# EAGLE design mini_optronV3 (EAGLE 9.3.1)
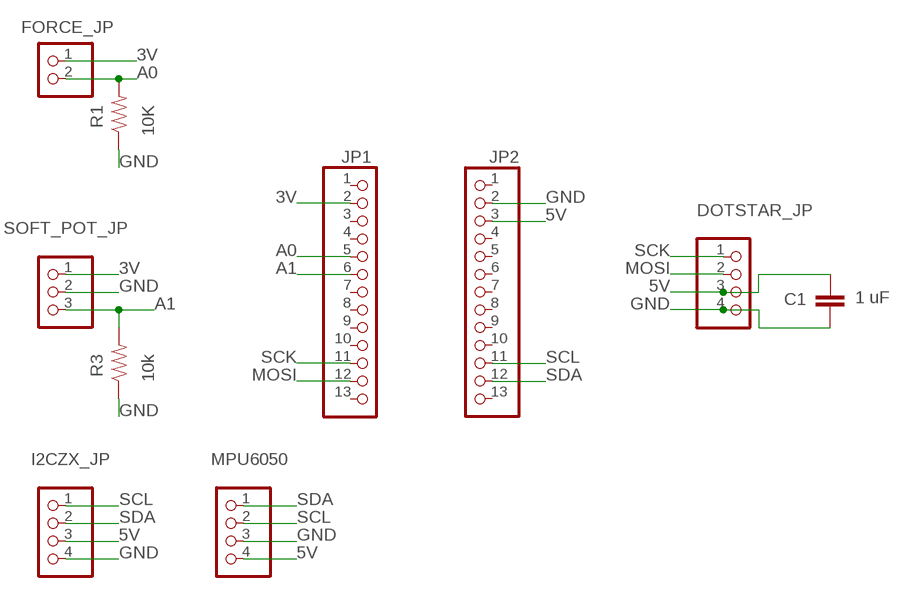
[diagram p0: schematic, sheet 1]

## Parts
C1  1 uF  C5/7.2  [C5B7.2]
DOTSTAR_JP  PINHD-1X4  [1X04]
FORCE_JP  PINHD-1X2  [1X02]
I2CZX_JP  PINHD-1X4  [1X04]
JP1  PINHD-1X13_BIG  [1X13-BIG]
JP2  PINHD-1X13_BIG  [1X13-BIG]
MPU6050  PINHD-1X4  [1X04]
R1  10K  RESISTORAXIAL-0.3  [AXIAL-0.3]
R3  10k  RESISTORAXIAL-0.3  [AXIAL-0.3]
SOFT_POT_JP  PINHD-1X3  [1X03]

## Nets
3V: FORCE_JP.1 JP1.2 SOFT_POT_JP.1
5V: C1.1 DOTSTAR_JP.3 I2CZX_JP.3 JP2.3 MPU6050.4
A0: FORCE_JP.2 JP1.5 R1.P$2
A1: JP1.6 R3.P$2 SOFT_POT_JP.3
GND: C1.2 DOTSTAR_JP.4 I2CZX_JP.4 JP2.2 MPU6050.3 R1.P$1 R3.P$1 SOFT_POT_JP.2
MOSI: DOTSTAR_JP.2 JP1.12
SCK: DOTSTAR_JP.1 JP1.11
SCL: I2CZX_JP.1 JP2.11 MPU6050.2
SDA: I2CZX_JP.2 JP2.12 MPU6050.1
Unconnected: JP1.1 JP1.3 JP1.4 JP1.7 JP1.8 JP1.9 JP1.10 JP1.13 JP2.1 JP2.4 JP2.5 JP2.6 JP2.7 JP2.8 JP2.9 JP2.10 JP2.13

## Library data of the parts
C1 = capacitor-wima:C: CAPACITOR naming: grid - package width; MF: AVX; MPN: 0805YD105KAT2A; OC_NEWARK: 95W9236
DOTSTAR_JP I2CZX_JP MPU6050 = pinhead:PINHD-1X4: PIN HEADER
FORCE_JP = pinhead:PINHD-1X2: PIN HEADER
JP1 JP2 = adafruit:PINHD-1X13: PIN HEADER; OC_NEWARK: unknown
R1 R3 = SparkFun-Resistors:RESISTOR: Generic Resistor Package; MF: VISHAY; MPN: CRCW060310K0FKEA; OC_NEWARK: 52K8063
SOFT_POT_JP = pinhead:PINHD-1X3: PIN HEADER

## Net classes
0 default: width 0.305 mm, drill 0.508 mm, clearance 0.254 mm

## Board
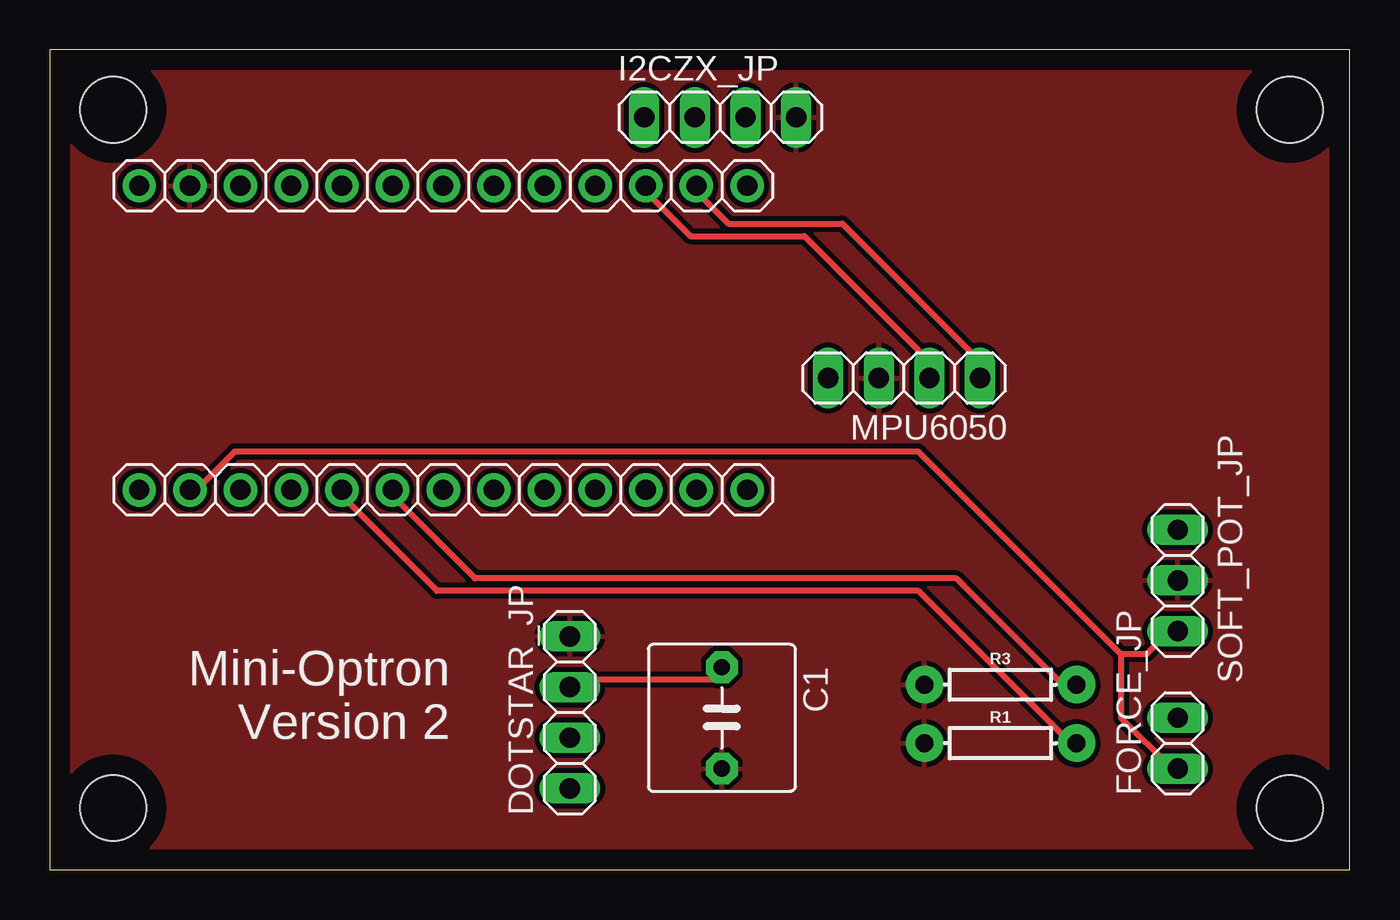
[diagram p1: board, top side]
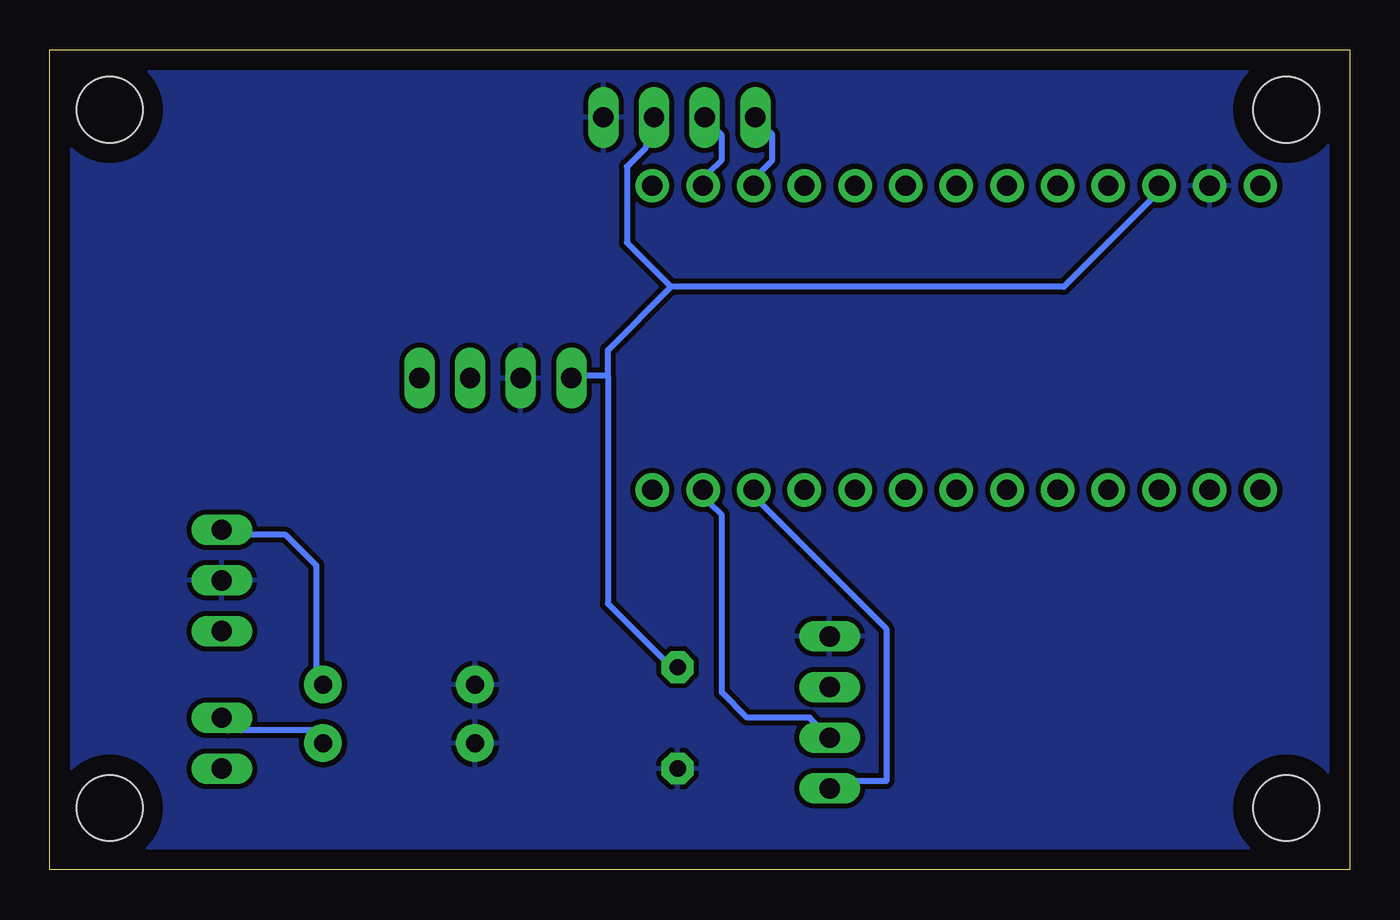
[diagram p2: board, bottom side, seen from below]

Size 65.17 x 41.09 mm. Coordinates in mm from the lower left corner, seen from the top.
Outline: 65.17,41.09 0,41.09 0,0 65.17,0 65.17,41.09
Copper layers (1*16): Top 0.035mm / dielectric 1.5mm / Bottom 0.035mm
Design rules "default": minimum track width 6mil, minimum drill 0.35mm, track to track 6mil, track to pad 6mil, pad to pad 6mil, via to via 6mil, smd to smd 6mil, copper to edge 40mil, drill to drill 6mil, minimum pad ring 10mil, minimum via ring 8mil, stop-mask expansion 4mil, vias tented up to drill 0mil, thermal gap 10mil
Holes 3.3 mm at 62.17,38.09 62.17,3.09 3.17,3.09 3.17,38.09

### Footprints (pad centres in the part's own frame; a part is rotated, then mirrored left to right if it is on the bottom)
C5B7.2 = drill 0.813 pad 1.6 octagon: 1 -2.54,0; 2 2.54,0
1X04 = drill 1.016 long: 1 -3.81,0; 2 -1.27,0; 3 1.27,0; 4 3.81,0
1X02 = drill 1.016 long: 1 -1.27,0; 2 1.27,0
1X13-BIG = drill 1.016 pad 1.676: 1 -15.24,0; 2 -12.7,0; 3 -10.16,0; 4 -7.62,0; 5 -5.08,0; 6 -2.54,0; 7 0,0; 8 2.54,0; 9 5.08,0; 10 7.62,0; 11 10.16,0; 12 12.7,0; 13 15.24,0
AXIAL-0.3 = drill 0.9 pad 1.88: P$1 -3.81,0; P$2 3.81,0
1X03 = drill 1.016 long: 1 -2.54,0; 2 0,0; 3 2.54,0

### Placement (x,y rotation side)
C1  33.69,7.61 270 top
DOTSTAR_JP  26.07,7.88 90 top
FORCE_JP  56.55,6.34 90 top
I2CZX_JP  33.61,37.71 0 top
JP1  19.72,19.04 0 top
JP2  19.72,34.28 0 top
MPU6050  42.83,24.64 180 top
R1  47.66,6.34 0 top
R3  47.66,9.27 0 top
SOFT_POT_JP  56.55,14.5 90 top

### Tracks (layer width: path | path; a pad name or v marks a point on that pad's centre or on a via)
3V
  Top 0.305: 53.7,10.8 53.7,7.62 56.24,5.08 FORCE_JP.1 | 53.7,10.8 54.97,10.8 55.61,11.43 56.24,11.43 SOFT_POT_JP.1 | 53.7,10.8 43.54,20.96 9.25,20.96 7.35,19.05 JP1.2
5V
  Top 0.305: DOTSTAR_JP.3 26.4,9.53 33.38,9.53 C1.1
  Bottom 0.305: 37.19,24.77 38.46,24.77 MPU6050.4 | I2CZX_JP.3 35.29,37.47 35.29,36.2 36.24,35.24 36.24,31.43 34.02,29.21 | JP2.3 9.89,33.66 14.33,29.21 34.02,29.21 | 37.19,24.77 37.19,13.34 34.02,10.16 C1.1 | 37.19,24.77 37.19,26.03 34.02,29.21
A0
  Top 0.305: JP1.5 14.97,18.42 19.41,13.97 43.54,13.97 51.16,6.35 R1.P$2
  Bottom 0.305: FORCE_JP.2 56.24,6.99 51.8,6.99 51.8,6.35 R1.P$2
A1
  Top 0.305: JP1.6 17.51,18.42 21.32,14.61 45.45,14.61 50.53,9.53 51.16,9.53 R3.P$2
  Bottom 0.305: SOFT_POT_JP.3 56.4,16.79 53.34,16.79 51.8,15.24 51.8,9.6 R3.P$2 51.8,9.53
GND
  pour Top: 66.44,-1.28 66.44,42.36 -1.6,42.36 -1.6,-1.28
  pour Bottom: 66.44,-1.28 66.44,42.36 -1.6,42.36 -1.6,-1.28
MOSI
  Bottom 0.305: 26.4,6.99 DOTSTAR_JP.2 27.08,7.62 30.21,7.62 31.48,8.89 31.48,17.78 32.11,18.42 JP1.12
SCK
  Bottom 0.305: DOTSTAR_JP.1 25.76,4.45 23.22,4.45 23.22,12.07 29.57,18.42 JP1.11
SCL
  Top 0.305: MPU6050.2 43.54,24.77 43.54,26.03 37.83,31.75 32.11,31.75 30.21,33.66 JP2.11
  Bottom 0.305: I2CZX_JP.1 29.57,37.47 28.94,36.83 28.94,35.56 29.57,34.92 29.57,34.29 JP2.11
SDA
  Top 0.305: MPU6050.1 46.08,24.77 46.08,26.03 39.73,32.39 34.02,32.39 32.75,33.66 JP2.12
  Bottom 0.305: I2CZX_JP.2 32.11,37.47 31.48,36.83 31.48,35.56 32.11,34.92 32.11,34.29 JP2.12

### Text on the board
tNames: Mini-Optron / Version 2